# EAGLE design Carte_électronique_contoleur_midi (EAGLE 7.6.0)
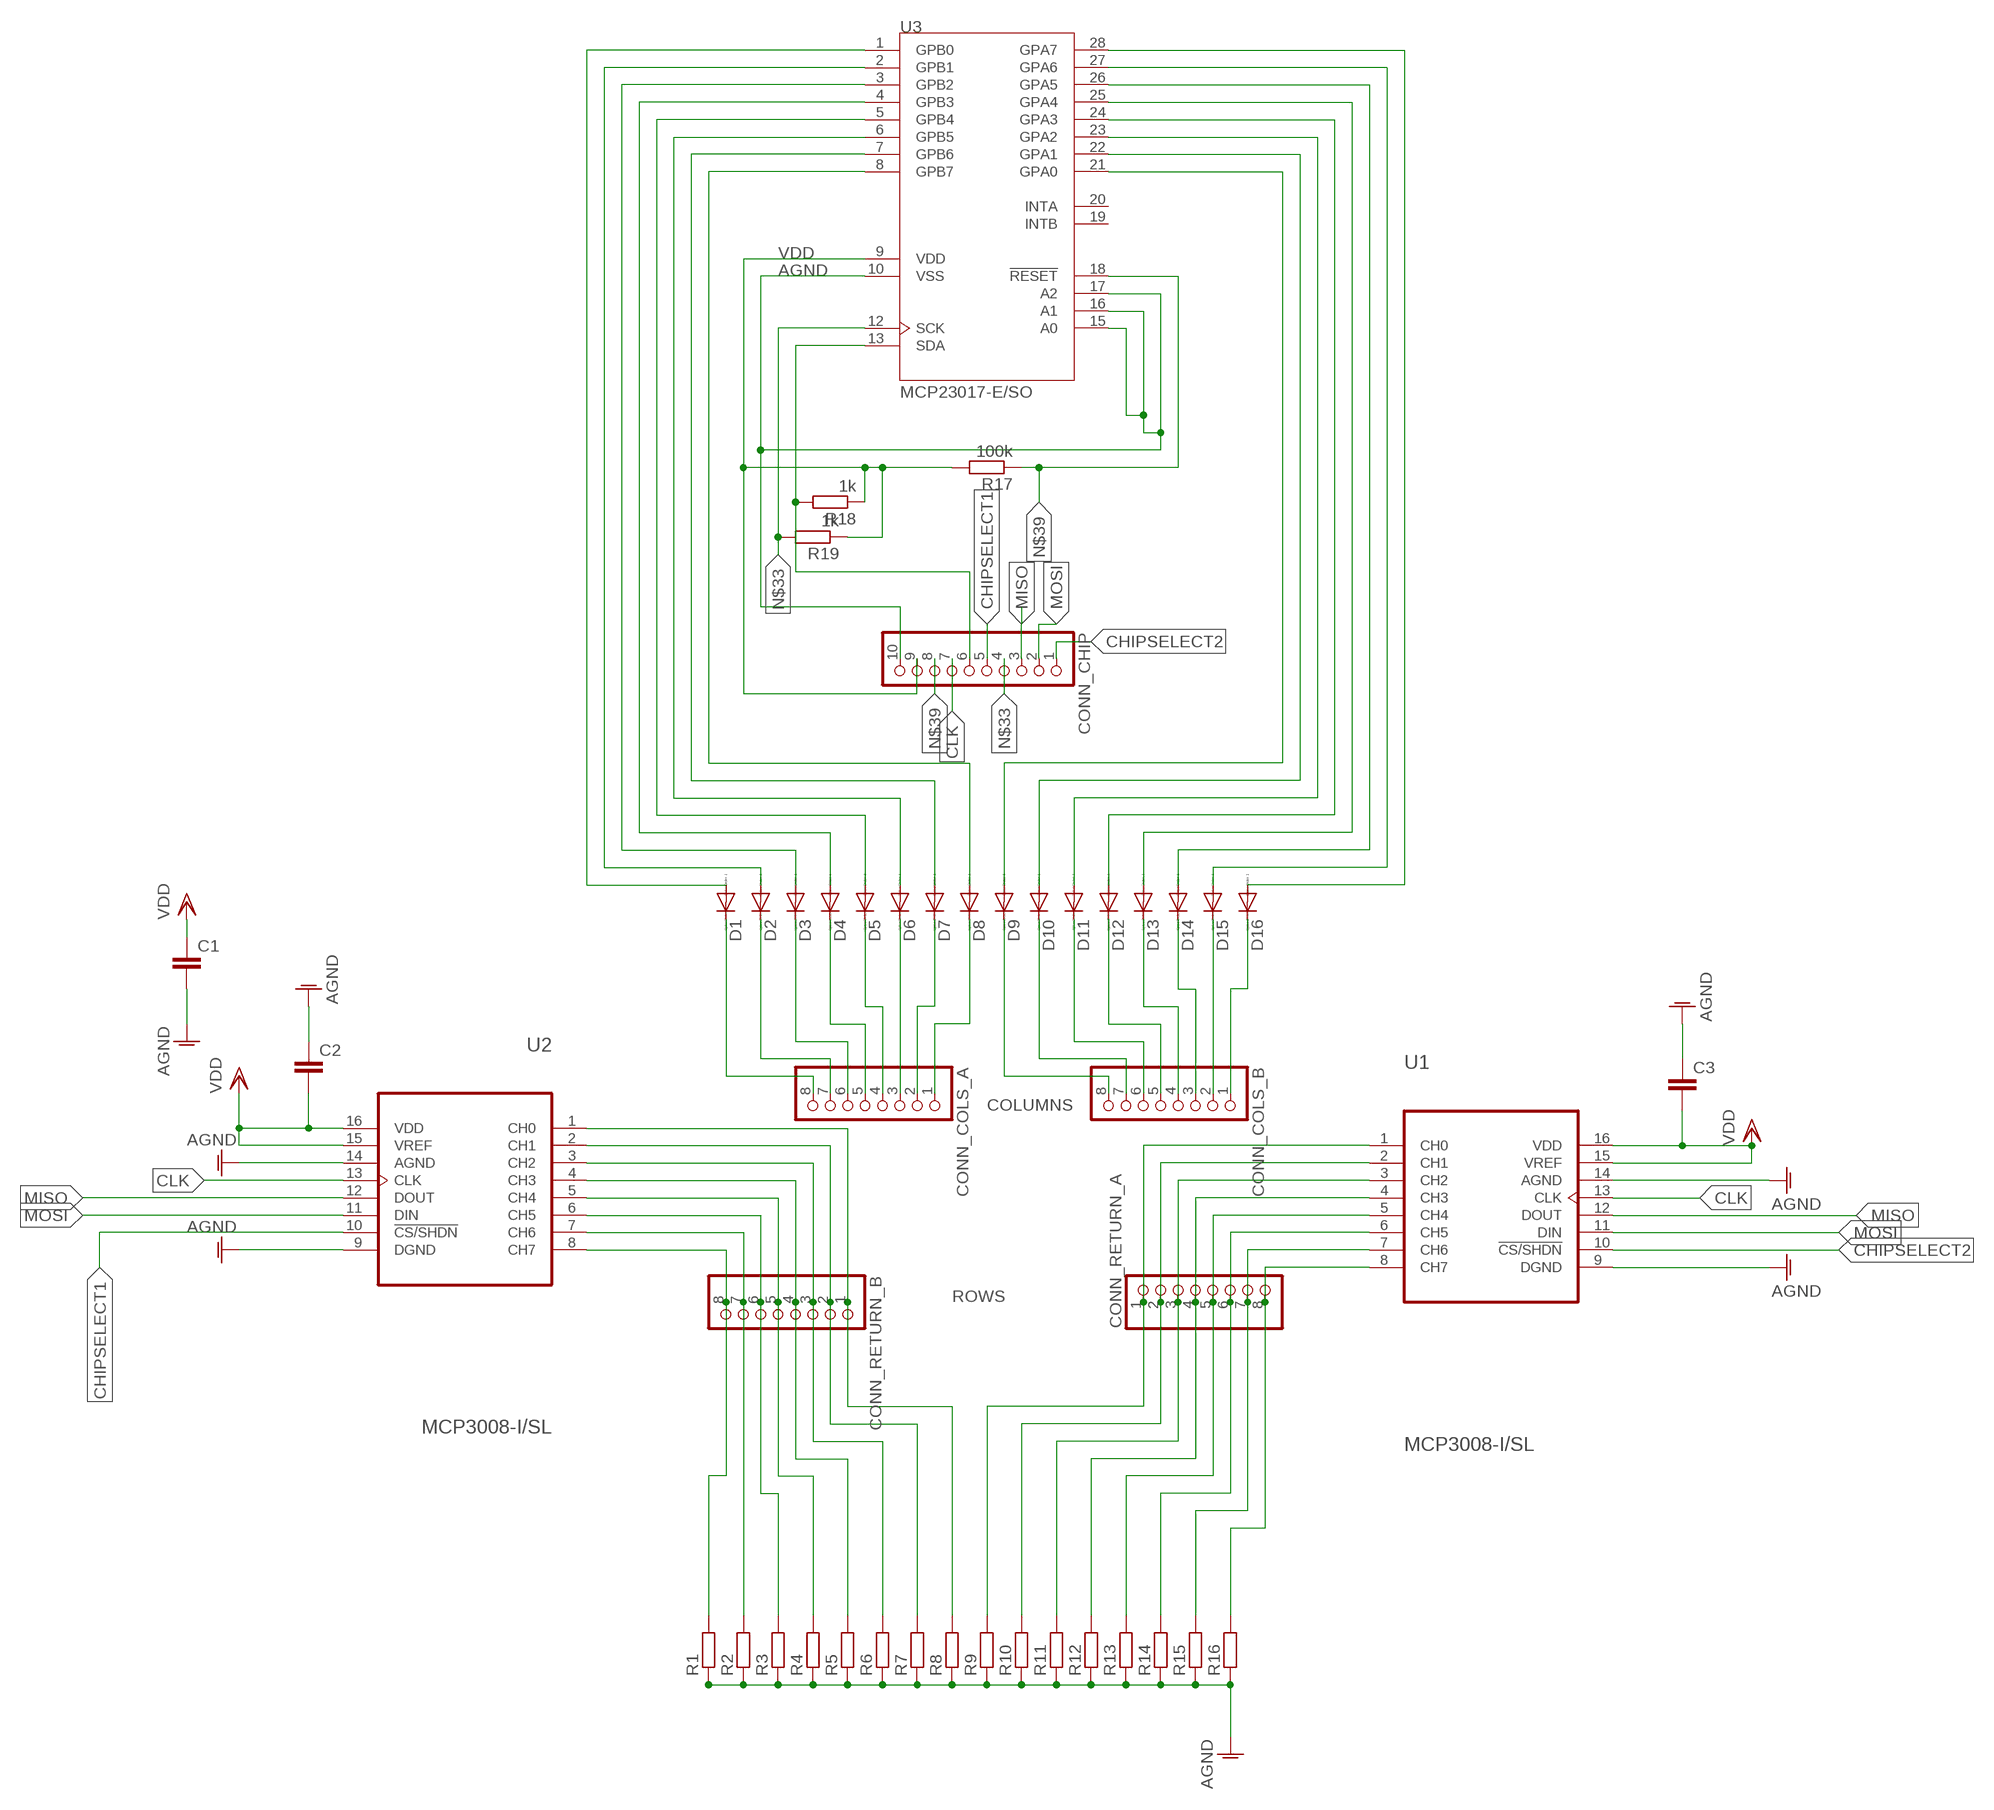
[diagram p0: schematic, sheet 1]

## Parts
C1  C-EUC1206K  [C1206K]
C2  C-EUC1206K  [C1206K]
C3  C-EUC1206K  [C1206K]
CONN_CHIP  PINHD-1X10/90  [1X10/90]
CONN_COLS_A  PINHD-1X8/90  [1X08/90]
CONN_COLS_B  PINHD-1X8/90  [1X08/90]
CONN_RETURN_A  PINHD-1X8/90  [1X08/90]
CONN_RETURN_B  PINHD-1X8/90  [1X08/90]
D1  DIODE-SOD323-W  [SOD323-W]
D2  DIODE-SOD323-W  [SOD323-W]
D3  DIODE-SOD323-W  [SOD323-W]
D4  DIODE-SOD323-W  [SOD323-W]
D5  DIODE-SOD323-W  [SOD323-W]
D6  DIODE-SOD323-W  [SOD323-W]
D7  DIODE-SOD323-W  [SOD323-W]
D8  DIODE-SOD323-W  [SOD323-W]
D9  DIODE-SOD323-W  [SOD323-W]
D10  DIODE-SOD323-W  [SOD323-W]
D11  DIODE-SOD323-W  [SOD323-W]
D12  DIODE-SOD323-W  [SOD323-W]
D13  DIODE-SOD323-W  [SOD323-W]
D14  DIODE-SOD323-W  [SOD323-W]
D15  DIODE-SOD323-W  [SOD323-W]
D16  DIODE-SOD323-W  [SOD323-W]
R1  R-EU_M1206  [M1206]
R2  R-EU_M1206  [M1206]
R3  R-EU_M1206  [M1206]
R4  R-EU_M1206  [M1206]
R5  R-EU_M1206  [M1206]
R6  R-EU_M1206  [M1206]
R7  R-EU_M1206  [M1206]
R8  R-EU_M1206  [M1206]
R9  R-EU_M1206  [M1206]
R10  R-EU_M1206  [M1206]
R11  R-EU_M1206  [M1206]
R12  R-EU_M1206  [M1206]
R13  R-EU_M1206  [M1206]
R14  R-EU_M1206  [M1206]
R15  R-EU_M1206  [M1206]
R16  R-EU_M1206  [M1206]
R17  100k  R-EU_M1206  [M1206]
R18  1k  R-EU_M1206  [M1206]
R19  1k  R-EU_M1206  [M1206]
U1  MCP3008-I/SL  [SOIC127P600X175-16N]
U2  MCP3008-I/SL  [SOIC127P600X175-16N]
U3  MCP23017-E/SO  [SOIC127P1030X265-28N]

## Nets
AGND: C1.2 C2.1 C3.1 CONN_CHIP.10 R1.1 R2.1 R3.1 R4.1 R5.1 R6.1 R7.1 R8.1 R9.1 R10.1 R11.1 R12.1 R13.1 R14.1 R15.1 R16.1 U1.9(DGND) U1.14(AGND) U2.9(DGND) U2.14(AGND) U3.10(VSS) U3.15(A0) U3.16(A1) U3.17(A2)
CHIPSELECT1: CONN_CHIP.5 U2.10(!CS/SHDN)
CHIPSELECT2: CONN_CHIP.1 U1.10(!CS/SHDN)
CLK: CONN_CHIP.7 U1.13(CLK) U2.13(CLK)
MISO: CONN_CHIP.3 U1.12(DOUT) U2.12(DOUT)
MOSI: CONN_CHIP.2 U1.11(DIN) U2.11(DIN)
N$1: D8.A U3.8(GPB7)
N$2: D7.A U3.7(GPB6)
N$3: D6.A U3.6(GPB5)
N$4: D5.A U3.5(GPB4)
N$5: D4.A U3.4(GPB3)
N$6: D3.A U3.3(GPB2)
N$7: D2.A U3.2(GPB1)
N$8: D1.A U3.1(GPB0)
N$9: D9.A U3.21(GPA0)
N$10: D10.A U3.22(GPA1)
N$11: D11.A U3.23(GPA2)
N$12: D12.A U3.24(GPA3)
N$13: D13.A U3.25(GPA4)
N$14: D14.A U3.26(GPA5)
N$15: D15.A U3.27(GPA6)
N$16: D16.A U3.28(GPA7)
N$17: CONN_COLS_A.8 D1.C
N$18: CONN_COLS_A.7 D2.C
N$19: CONN_COLS_A.6 D3.C
N$20: CONN_COLS_A.5 D4.C
N$21: CONN_COLS_A.4 D5.C
N$22: CONN_COLS_A.3 D6.C
N$23: CONN_COLS_A.2 D7.C
N$24: CONN_COLS_A.1 D8.C
N$25: CONN_COLS_B.8 D9.C
N$26: CONN_COLS_B.7 D10.C
N$27: CONN_COLS_B.6 D11.C
N$28: CONN_COLS_B.5 D12.C
N$29: CONN_COLS_B.4 D13.C
N$30: CONN_COLS_B.3 D14.C
N$31: CONN_COLS_B.2 D15.C
N$32: CONN_COLS_B.1 D16.C
N$33: CONN_CHIP.4 R19.2 U3.12(SCK)
N$35: CONN_CHIP.6 R18.2 U3.13(SDA)
N$39: CONN_CHIP.8 R17.1 U3.18(!RESET)
N$41: CONN_RETURN_B.1 R8.2 U2.1(CH0)
N$42: CONN_RETURN_B.2 R7.2 U2.2(CH1)
N$43: CONN_RETURN_B.3 R6.2 U2.3(CH2)
N$45: CONN_RETURN_B.5 R4.2 U2.5(CH4)
N$46: CONN_RETURN_B.6 R3.2 U2.6(CH5)
N$47: CONN_RETURN_B.7 R2.2 U2.7(CH6)
N$48: CONN_RETURN_B.8 R1.2 U2.8(CH7)
N$49: CONN_RETURN_A.2 R10.2 U1.2(CH1)
N$51: CONN_RETURN_A.3 R11.2 U1.3(CH2)
N$52: CONN_RETURN_A.4 R12.2 U1.4(CH3)
N$53: CONN_RETURN_A.1 R9.2 U1.1(CH0)
N$54: CONN_RETURN_A.5 R13.2 U1.5(CH4)
N$55: CONN_RETURN_A.6 R14.2 U1.6(CH5)
N$56: CONN_RETURN_A.7 R15.2 U1.7(CH6)
N$59: CONN_RETURN_A.8 R16.2 U1.8(CH7)
N$60: CONN_RETURN_B.4 R5.2 U2.4(CH3)
VDD: C1.1 C2.2 C3.2 CONN_CHIP.9 R17.2 R18.1 R19.1 U1.15(VREF) U1.16(VDD) U2.15(VREF) U2.16(VDD) U3.9(VDD)
Unconnected: U3.19(INTB) U3.20(INTA)

## Notes on the sheet
- COLUMNS
- ROWS

## Library data of the parts
C1-C3 = rcl:C-EU: CAPACITOR, European symbol
CONN_CHIP = pinhead:PINHD-1X10: PIN HEADER
CONN_COLS_A CONN_COLS_B CONN_RETURN_A CONN_RETURN_B = pinhead:PINHD-1X8: PIN HEADER
D1-D16 = diode:DIODE-: DIODE
R1-R19 = rcl:R-EU_: RESISTOR, European symbol
U1 U2 = MCP3008-I_SL:MCP3008-I/SL: Check availability <https://pricing.snapeda.com/parts/MCP3008-I/SL/Microchip%20Technology/view-part?ref=eda>; AVAILABILITY: In Stock; DESCRIPTION: 10 Bit Analog to Digital Converter 4, 8 Input 1 SAR 16-SOIC; MF: Microchip Technology; MP: MCP3008-I/SL; PACKAGE: None; PRICE: None; PURCHASE-URL: https://pricing.snapeda.com/search/part/MCP3008-I/SL/?ref=eda
U3 = MCP23017-E_SO:MCP23017-E/SO: MCP23017 Series 5.5 V 1.7 MHz SMT 16-Bit I2C I/O Expander - SOIC-28 Check availability <https://pricing.snapeda.com/parts/MCP23017-E/SO/Microchip%20Technology/view-part?ref=eda>; AVAILABILITY: In Stock; DESCRIPTION: I/O Expander 16 I²C 1.7 MHz 28-SOIC; MF: Microchip Technology; MP: MCP23017-E/SO; PACKAGE: None; PRICE: None; PURCHASE-URL: https://pricing.snapeda.com/search/part/MCP23017-E/SO/?ref=eda

## Board
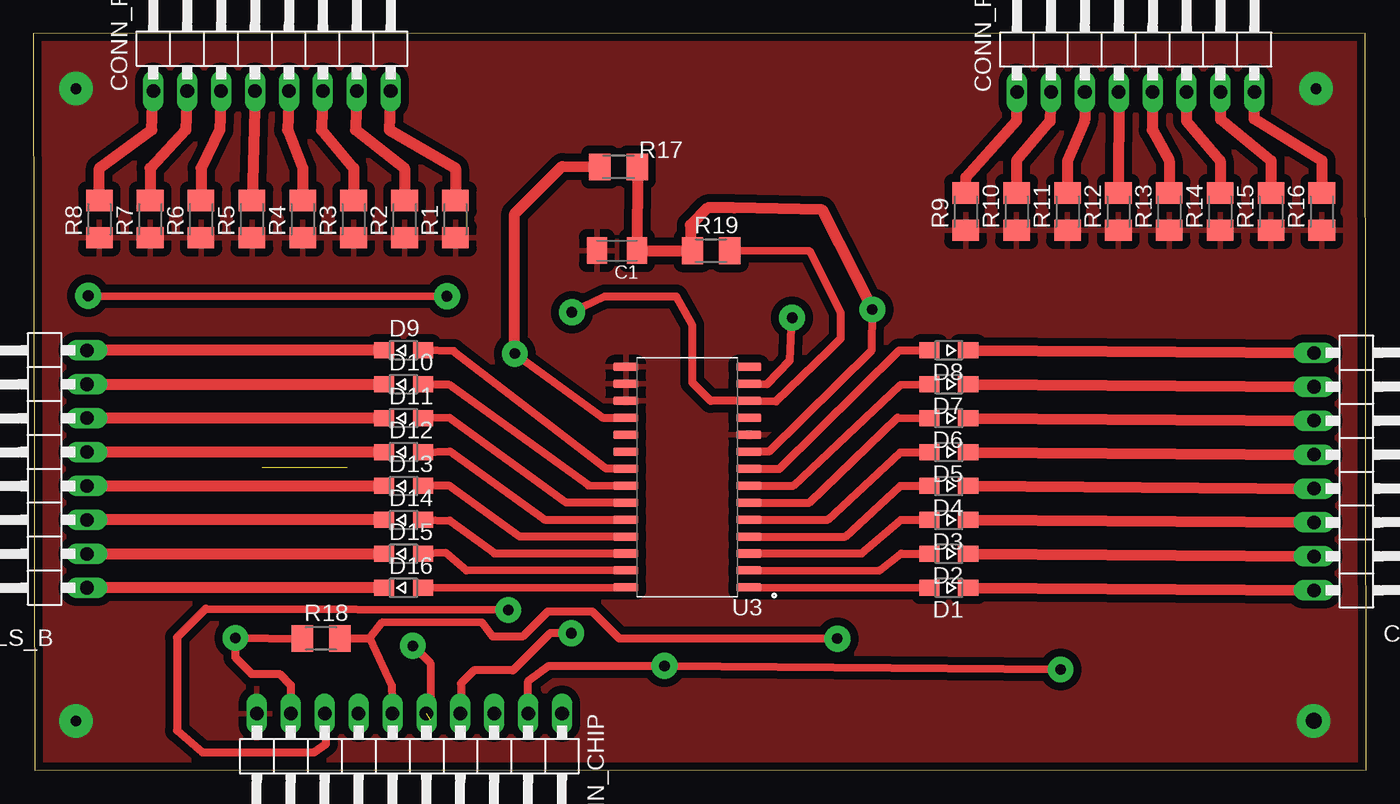
[diagram p1: board, top side]
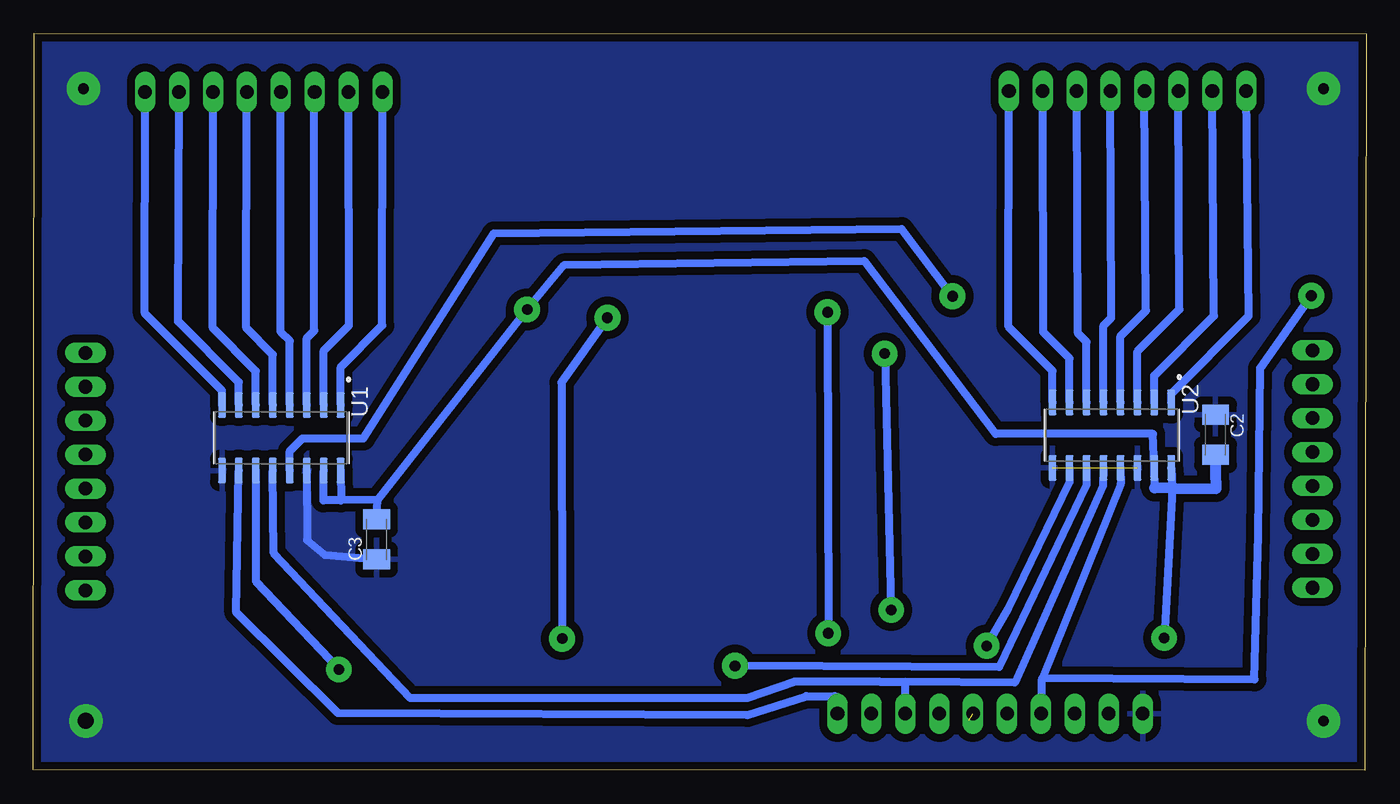
[diagram p2: board, bottom side, seen from below]

Size 99.83 x 55.19 mm. Coordinates in mm from the lower left corner, seen from the top.
Outline: 0.11,0 99.83,0.07 99.77,55.19 0,55.17 0.11,0
Copper layers (1*16): Top 0.035mm / dielectric 1.5mm / Bottom 0.035mm
Design rules "default *": minimum track width 10mil, minimum drill 24mil, track to track 8mil, track to pad 8mil, pad to pad 8mil, via to via 8mil, smd to smd 8mil, copper to edge 0.5mm, drill to drill 0.8mm, minimum pad ring 10mil, minimum via ring 8mil, stop-mask expansion 4mil, vias tented up to drill 0mil, thermal gap 0.6mm

### Footprints (pad centres in the part's own frame; a part is rotated, then mirrored left to right if it is on the bottom)
C1206K = smd 1.5 x 2: 1 -1.5,0; 2 1.5,0
1X10/90 = drill 1.016 long: 1 -11.43,-3.81; 2 -8.89,-3.81; 3 -6.35,-3.81; 4 -3.81,-3.81; 5 -1.27,-3.81; 6 1.27,-3.81; 7 3.81,-3.81; 8 6.35,-3.81; 9 8.89,-3.81; 10 11.43,-3.81
1X08/90 = drill 1.016 long: 1 -8.89,-3.81; 2 -6.35,-3.81; 3 -3.81,-3.81; 4 -1.27,-3.81; 5 1.27,-3.81; 6 3.81,-3.81; 7 6.35,-3.81; 8 8.89,-3.81
SOD323-W = smd 1.5 x 1.2: A 1.45,0; C -1.45,0
M1206 = smd 1.6 x 2: 1 -1.4,0; 2 1.4,0
SOIC127P600X175-16N = smd 1.9 x 0.6: 1 -2.455,4.445; 2 -2.455,3.175; 3 -2.455,1.905; 4 -2.455,0.635; 5 -2.455,-0.635; 6 -2.455,-1.905; 7 -2.455,-3.175; 8 -2.455,-4.445; 9 2.455,-4.445; 10 2.455,-3.175; 11 2.455,-1.905; 12 2.455,-0.635; 13 2.455,0.635; 14 2.455,1.905; 15 2.455,3.175; 16 2.455,4.445
SOIC127P1030X265-28N = smd 1.9 x 0.6: 1 -4.605,8.255; 2 -4.605,6.985; 3 -4.605,5.715; 4 -4.605,4.445; 5 -4.605,3.175; 6 -4.605,1.905; 7 -4.605,0.635; 8 -4.605,-0.635; 9 -4.605,-1.905; 10 -4.605,-3.175; 11 -4.605,-4.445; 12 -4.605,-5.715; 13 -4.605,-6.985; 14 -4.605,-8.255; 15 4.605,-8.255; 16 4.605,-6.985; 17 4.605,-5.715; 18 4.605,-4.445; 19 4.605,-3.175; 20 4.605,-1.905; 21 4.605,-0.635; 22 4.605,0.635; 23 4.605,1.905; 24 4.605,3.175; 25 4.605,4.445; 26 4.605,5.715; 27 4.605,6.985; 28 4.605,8.255

### Placement (x,y rotation side)
C1  43.71,38.93 180 top
C2  11.28,25.14 270 bottom
C3  74.12,17.3 90 bottom
CONN_CHIP  28.17,0.44 180 top
CONN_COLS_A  99.74,22.38 270 top
CONN_COLS_B  0.21,22.57 90 top
CONN_RETURN_A  82.57,54.62 0 top
CONN_RETURN_B  17.87,54.68 0 top
D1  68.57,13.68 180 top
D2  68.57,16.22 180 top
D3  68.57,18.76 180 top
D4  68.57,21.3 180 top
D5  68.57,23.84 180 top
D6  68.57,26.38 180 top
D7  68.57,28.92 180 top
D8  68.57,31.46 180 top
D9  27.73,31.46 0 top
D10  27.73,28.92 0 top
D11  27.73,26.38 0 top
D12  27.73,23.84 0 top
D13  27.73,21.3 0 top
D14  27.73,18.76 0 top
D15  27.73,16.22 0 top
D16  27.73,13.68 0 top
R1  31.61,41.29 90 top
R2  27.8,41.29 90 top
R3  23.99,41.29 90 top
R4  20.18,41.29 90 top
R5  16.37,41.29 90 top
R6  12.56,41.29 90 top
R7  8.75,41.29 90 top
R8  4.94,41.29 90 top
R9  69.84,41.85 90 top
R10  73.65,41.85 90 top
R11  77.46,41.85 90 top
R12  81.27,41.85 90 top
R13  85.08,41.85 90 top
R14  88.89,41.85 90 top
R15  92.7,41.85 90 top
R16  96.51,41.85 90 top
R17  43.84,45.19 0 top
R18  21.55,9.88 0 top
R19  50.77,38.91 0 top
U1  81.26,24.91 270 bottom
U2  19.04,25.11 270 bottom
U3  48.98,21.96 180 top

### Tracks (layer width: path | path; a pad name or v marks a point on that pad's centre or on a via)
AGND  (via drill 0.8 pad 2.5, 1.2 pad 2.5)  (1 unrouted)
  Bottom 0.254: 74.56,15.33 C3.1
  Bottom 0.61: U1.14 79.33,17.25 78.01,16.14 C3.1
  other vias: 3.19,51.05 95.9,3.71 3.19,3.71 96.07,51.05
  pour Bottom (isolate 0.6): -4.35,57.46 103.36,58.36 102.97,-1.76 -4.27,-1.31
  pour Top (isolate 0.6): -4.37,57.69 103.27,57.92 102.88,-1.33 -4,-0.88
CHIPSELECT1  (via drill 0.8 pad 1.93)  (1 unrouted)
  Top 0.61: v28.43,9.33 29.74,8.02 29.74,3.77
  Bottom 0.61: U2.10 22.21,21.6 26.82,12.12 v28.43,9.33
CHIPSELECT2
  Bottom 0.61: U1.10 84.62,11.84 77.01,4.3 46.4,4.14 41.94,5.56 39.8,5.56 39.61,5.5 CONN_CHIP.1
CLK  (via drill 0.8 pad 1.93)
  Top 0.61: v4.11,35.54 v30.98,35.51
  Bottom 0.61: U2.13 18.38,21.47 24.26,6.89 | U1.13 80.62,23.91 79.67,24.86 75.11,24.86 65.33,40.21 34.8,40.56 v30.98,35.51 | v4.11,35.54 7.94,30.13 8.09,17.69 8.36,6.81 24.26,6.89 | 24.26,6.89 24.31,6.74 CONN_CHIP.7
MISO
  Bottom 0.61: U1.12 81.82,16.27 71.58,5.42 46.38,5.42 42.8,6.65 36.47,6.66 34.52,6.62 | U2.12 19.72,21.33 26.32,6.58 34.52,6.62 | CONN_CHIP.3 34.52,6.62
MOSI  (via drill 0.8 pad 1.93)
  Top 0.61: v76.94,7.56 v47.28,7.83 38.62,7.84 37.06,6.68 CONN_CHIP.2
  Bottom 0.61: U2.11 20.95,21.41 27.5,7.73 v47.28,7.83 47.17,8.26 | U1.11 83.17,14.18 v76.94,7.56
N$1
  Top 0.61: U3.8 55.88,22.59 64.86,31.45 D8.A
N$2
  Top 0.61: U3.7 56.92,21.32 64.95,28.88 D7.A
N$3
  Top 0.61: U3.6 58.13,20.05 64.74,26.41 D6.A
N$4
  Top 0.61: U3.5 59.5,18.79 64.94,23.81 D5.A
N$5
  Top 0.61: U3.4 60.82,17.51 64.93,21.31 D4.A
N$6
  Top 0.61: U3.3 62.04,16.26 64.97,18.77 D3.A
N$7
  Top 0.61: U3.2 63.36,14.96 65,16.24 D2.A
N$8
  Top 0.61: U3.1 D1.A
N$9
  Top 0.61: U3.21 42.92,22.6 31.49,31.4 D9.A
N$10
  Top 0.61: D10.A 31.09,28.9 41.57,21.35 U3.22
N$11
  Top 0.61: U3.23 39.93,20.05 31.19,26.4 D11.A
N$12
  Top 0.61: D12.A 31.19,23.9 38.29,18.79 U3.24
N$13
  Top 0.61: U3.25 36.45,17.5 31.19,21.3 D13.A
N$14
  Top 0.61: D14.A 31.19,18.7 34.54,16.25 U3.26
N$15
  Top 0.61: U3.27 32.44,14.97 30.89,16.3 D15.A
N$16
  Top 0.61: D16.A U3.28
N$17
  Top 0.813: D1.C CONN_COLS_A.8
N$18
  Top 0.813: D2.C CONN_COLS_A.7
N$19
  Top 0.813: D3.C CONN_COLS_A.6
N$20
  Top 0.813: D4.C CONN_COLS_A.5
N$21
  Top 0.813: D5.C CONN_COLS_A.4
N$22
  Top 0.813: D6.C CONN_COLS_A.3
N$23
  Top 0.813: D7.C CONN_COLS_A.2
N$24
  Top 0.813: D8.C CONN_COLS_A.1
N$25
  Top 0.813: D9.C CONN_COLS_B.8
N$26
  Top 0.813: CONN_COLS_B.7 D10.C
N$27
  Top 0.813: D11.C CONN_COLS_B.6
N$28
  Top 0.813: D12.C CONN_COLS_B.5
N$29
  Top 0.813: CONN_COLS_B.4 D13.C
N$30
  Top 0.813: D14.C CONN_COLS_B.3
N$31
  Top 0.813: CONN_COLS_B.2 D15.C
N$32
  Top 0.813: D16.C CONN_COLS_B.1
N$33  (via drill 0.8 pad 1.93)
  Top 0.61: R19.2 58.16,38.86 60.49,34.26 60.49,32.36 59.55,31.42 55.63,27.64 U3.12 50.73,27.67 49.36,29.04 49.36,33.32 48.17,35.47 42.79,35.47 v40.34,34.31 | v40.29,10.28 38.71,10.28 35.93,7.5 33,7.5 32.02,6.52 32.02,4.29 CONN_CHIP.4
  Bottom 0.61: v40.34,34.31 v40.29,10.28
N$35  (via drill 0.8 pad 1.93)
  Top 0.61: U3.13 54.96,28.93 56.66,30.7 v56.83,33.9 | v60.22,9.87 43.9,9.87 41.87,11.9 38.52,11.9 36.64,10.02 34.4,10.02 33.6,11.07 26.13,11.08 25.19,9.88 | 25.19,9.88 26.84,6.35 CONN_CHIP.6 | R18.2 25.19,9.88
  Bottom 0.61: v56.83,33.9 60.28,29.06 v60.22,9.87
N$39  (via drill 0.8 pad 1.93)
  Top 0.61: v36.06,31.21 42.63,26.42 U3.18 | CONN_CHIP.8 21.92,1.99 21.03,1.35 12.67,1.35 10.77,3 10.77,9.97 12.92,12.12 v35.58,12.02
  Top 0.813: v36.06,31.21 36.06,41.69 39.61,45.24 R17.1
  Bottom 0.61: v36.06,31.21 v35.58,12.02
N$41
  Top 0.813: R8.2 4.94,45.1 8.88,47.97 CONN_RETURN_B.1
  Bottom 0.61: U2.1 14.6,28.23 8.79,34.03 CONN_RETURN_B.1
N$42
  Top 0.813: CONN_RETURN_B.2 11.42,47.97 8.75,45.1 R7.2
  Bottom 0.61: U2.2 15.87,29.55 11.39,34.03 CONN_RETURN_B.2
N$43
  Top 0.813: CONN_RETURN_B.3 13.96,47.97 12.56,45.1 R6.2
  Bottom 0.61: U2.3 17.13,31.38 13.99,34.53 CONN_RETURN_B.3
N$45
  Top 0.813: CONN_RETURN_B.5 19.04,47.97 20.18,45.1 R4.2
  Bottom 0.61: U2.5 19.67,33.3 19.09,33.89 CONN_RETURN_B.5
N$46
  Top 0.254: R3.2 24.06,42.83 23.99,42.83
  Top 0.813: CONN_RETURN_B.6 21.58,47.97 23.99,45.1 23.99,42.83 R3.2 23.99,42.56
  Bottom 0.61: U2.6 20.95,32.09 21.59,32.73 CONN_RETURN_B.6
N$47
  Top 0.813: CONN_RETURN_B.7 24.12,47.97 27.8,45.1 R2.2
  Bottom 0.61: U2.7 22.21,30.85 24.19,32.83 CONN_RETURN_B.7
N$48
  Top 0.813: CONN_RETURN_B.8 26.66,47.97 31.61,45.1 R1.2
  Bottom 0.61: U2.8 23.48,29.92 26.79,33.23 CONN_RETURN_B.8
N$49
  Top 0.813: CONN_RETURN_A.2 76.15,48.61 73.65,45.66 R10.2
  Bottom 0.61: U1.2 78.09,31.44 76.19,33.33 CONN_RETURN_A.2
N$51
  Top 0.813: CONN_RETURN_A.3 78.75,48.7 77.46,45.66 R11.2
  Bottom 0.61: U1.3 79.36,32.37 78.79,32.93 78.79,50.45 CONN_RETURN_A.3
N$52
  Top 0.813: CONN_RETURN_A.4 R12.2
  Bottom 0.61: U1.4 80.62,32.16 81.29,32.83 CONN_RETURN_A.4
N$53
  Top 0.813: R9.2 69.84,44.39 73.66,48.65 CONN_RETURN_A.1
  Bottom 0.61: U1.1 76.81,30.2 73.69,33.33 CONN_RETURN_A.1
N$54
  Top 0.813: CONN_RETURN_A.5 83.81,47.97 85.08,45.66 R13.2
  Bottom 0.61: U1.5 81.89,31.13 83.89,33.13 CONN_RETURN_A.5
N$55
  Top 0.813: CONN_RETURN_A.6 86.37,48.64 88.89,45.66 R14.2
  Bottom 0.61: U1.6 83.17,29.91 86.39,33.13 CONN_RETURN_A.6
N$56
  Top 0.813: CONN_RETURN_A.7 88.91,48.75 92.7,45.66 R15.2
  Bottom 0.61: U1.7 84.44,29.08 88.99,33.63 CONN_RETURN_A.7
N$59
  Top 0.813: CONN_RETURN_A.8 91.43,48.79 96.51,45.66 R16.2
  Bottom 0.61: U1.8 85.7,28.45 91.49,34.23 CONN_RETURN_A.8
N$60
  Top 0.813: CONN_RETURN_B.4 R5.2
  Bottom 0.61: U2.4 18.4,32.52 16.49,34.43 CONN_RETURN_B.4
VDD  (via drill 0.8 pad 1.93)
  Top 0.61: R18.1 v15.13,9.92 15.13,8.46 16.35,7.24 18.43,7.24 19.28,6.39 CONN_CHIP.9 | U3.9 55.09,23.87 62.81,31.48 v62.84,34.52
  Top 0.813: R17.2 C1.1 R19.1 | 49.5,39.04 R19.1 | v62.84,34.52 59.08,41.97 52.49,42.12 50.51,42.12 49.22,40.83 49.22,39.06 R19.1
  Bottom 0.61: U2.16 14.52,21.13 v15.13,9.92 | 15.83,21.16 U2.15 15.96,25.21 27.76,25.21 37.59,38.13 60.1,37.81 v62.84,34.52 74.04,20.28 | U1.16 76.79,20.22 | 76.79,20.22 78.1,20.23 U1.15 | C3.2 74.04,20.28 | 74.04,20.28 76.79,20.22
  Bottom 0.813: 15.83,21.16 14.52,21.13 11.24,21.11 C2.2